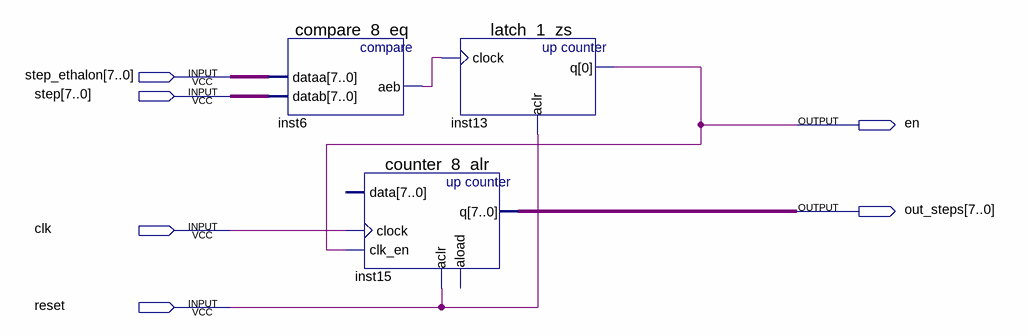
[diagram p0: schematic sheet]
// Quartus schematic reference_signals.bdf as structural Verilog: 3 symbols, 6 pins
module reference_signals (
  input  [7:0] step_ethalon,
  input  [7:0] step,
  input  clk,
  input  reset,
  output en,
  output [7:0] out_steps
);

  wire inst6_aeb;

  compare_8_eq inst6 (.dataa(step_ethalon), .datab(step), .aeb(inst6_aeb));
  counter_8_alr inst15 (.clock(clk), .clk_en(en), .aclr(reset), .q(out_steps));  // open: data, aload
  latch_1_zs inst13 (.clock(inst6_aeb), .aclr(reset), .q(en));
endmodule
